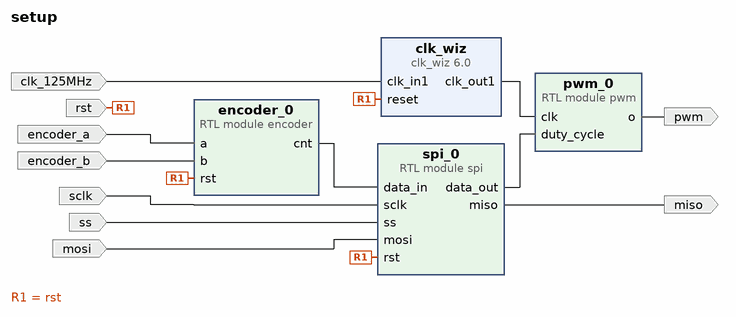
[diagram p0: block diagram of the top level]
# Vivado block design setup, xc7z020clg400-1, Vivado 2020.2
create_bd_design setup

create_bd_port -dir I -type rst rst
create_bd_port -dir I encoder_a
create_bd_port -dir I encoder_b
create_bd_port -dir I sclk
create_bd_port -dir I ss
create_bd_port -dir I mosi
create_bd_port -dir O miso
create_bd_port -dir O pwm
create_bd_port -dir I -type clk clk_125MHz
set_property -dict {CONFIG.FREQ_HZ 100000000} [get_bd_ports clk_125MHz]

create_bd_cell -type ip -vlnv xilinx.com:ip:clk_wiz:6.0 clk_wiz
set_property -dict [list \
  CONFIG.CLKIN1_JITTER_PS 80.0 \
  CONFIG.CLKIN2_JITTER_PS 133.33 \
  CONFIG.CLKOUT1_JITTER 529.616 \
  CONFIG.CLKOUT1_PHASE_ERROR 319.966 \
  CONFIG.CLKOUT1_REQUESTED_OUT_FREQ 5.000 \
  CONFIG.CLK_IN1_BOARD_INTERFACE sys_clock \
  CONFIG.MMCM_CLKFBOUT_MULT_F 25.500 \
  CONFIG.MMCM_CLKIN1_PERIOD 8.000 \
  CONFIG.MMCM_CLKIN2_PERIOD 10.0 \
  CONFIG.MMCM_CLKOUT0_DIVIDE_F 127.500 \
  CONFIG.MMCM_DIVCLK_DIVIDE 5 \
  CONFIG.PRIM_IN_FREQ 125.000 \
  CONFIG.SECONDARY_IN_FREQ 100.000 \
  CONFIG.SECONDARY_SOURCE Single_ended_clock_capable_pin \
  CONFIG.USE_INCLK_SWITCHOVER false \
] [get_bd_cells clk_wiz]
create_bd_cell -type module -reference encoder encoder_0
set_property -dict {CONFIG.n_bits 8} [get_bd_cells encoder_0]
create_bd_cell -type module -reference pwm pwm_0
set_property -dict {CONFIG.n_bits 8} [get_bd_cells pwm_0]
create_bd_cell -type module -reference spi spi_0

# ---- connections ----

connect_bd_net -net rst_0_1 [get_bd_ports rst] [get_bd_pins clk_wiz/reset] [get_bd_pins encoder_0/rst] [get_bd_pins spi_0/rst]
connect_bd_net -net a_0_1 [get_bd_ports encoder_a] [get_bd_pins encoder_0/a]
connect_bd_net -net b_0_1 [get_bd_ports encoder_b] [get_bd_pins encoder_0/b]
connect_bd_net [get_bd_pins encoder_0/cnt] [get_bd_pins spi_0/data_in]
connect_bd_net -net sclk_0_1 [get_bd_ports sclk] [get_bd_pins spi_0/sclk]
connect_bd_net -net ss_0_1 [get_bd_ports ss] [get_bd_pins spi_0/ss]
connect_bd_net -net mosi_0_1 [get_bd_ports mosi] [get_bd_pins spi_0/mosi]
connect_bd_net [get_bd_pins spi_0/miso] [get_bd_ports miso]
connect_bd_net [get_bd_pins clk_wiz/clk_out1] [get_bd_pins pwm_0/clk]
connect_bd_net [get_bd_pins spi_0/data_out] [get_bd_pins pwm_0/duty_cycle]
connect_bd_net [get_bd_pins pwm_0/o] [get_bd_ports pwm]
connect_bd_net -net clk_100MHz_1 [get_bd_ports clk_125MHz] [get_bd_pins clk_wiz/clk_in1]

validate_bd_design
save_bd_design
